# Altium schematic sheet BQ51013a.SchDoc
size A
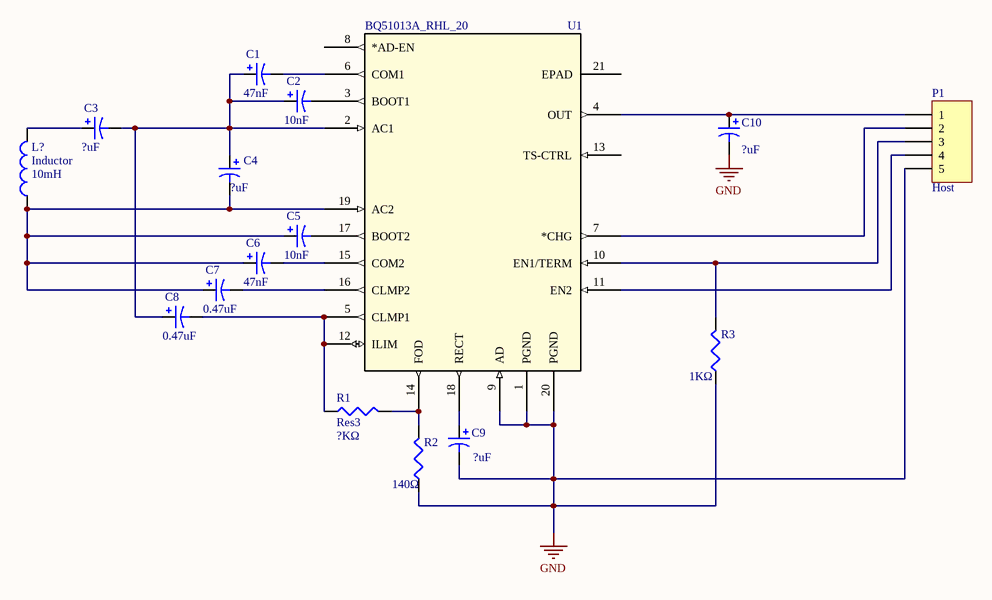
[diagram p0: BQ51013a.SchDoc]

## Parts
C1  value 47nF  [C0805]
C2  value 10nF  [C0805]
C3  value ?uF  [C0805]
C4  value ?uF  [C0805]
C5  value 10nF  [C0805]
C6  value 47nF  [C0805]
C7  value 0.47uF  [C0805]
C8  value 0.47uF  [C0805]
C9  value ?uF  [C0805]
C10  value ?uF  [C0805]
L?  Inductor  value 10mH  [0402-A]
P1  Host  [MHDR1X5]
R1  Res3  value ?KΩ  [J1-0603]
R2  value 140Ω  [J1-0603]
R3  value 1KΩ  [J1-0603]
U1  BQ51013A_RHL_20  [RHL20_2P05X3P05]

## Nets
GND: C9.2 C10.2 P1.5 R2.1 R3.1 U1.1(PGND) U1.9(AD) U1.20(PGND)
NetC1_1: C1.1 C2.1 C3.2 C4.1 C8.1 U1.2(AC1)
NetC1_2: C1.2 U1.6(COM1)
NetC2_2: C2.2 U1.3(BOOT1)
NetC3_1: C3.1 L?.2
NetC4_2: C4.2 C5.1 C6.1 C7.1 L?.1 U1.19(AC2)
NetC5_2: C5.2 U1.17(BOOT2)
NetC6_2: C6.2 U1.15(COM2)
NetC7_2: C7.2 U1.16(CLMP2)
NetC8_2: C8.2 R1.1 U1.5(CLMP1) U1.12(ILIM)
NetC9_1: C9.1 U1.18(RECT)
NetC10_1: C10.1 P1.1 U1.4(OUT)
NetP1_2: P1.2 U1.7(*CHG)
NetP1_3: P1.3 R3.2 U1.10(EN1/TERM)
NetP1_4: P1.4 U1.11(EN2)
NetR1_2: R1.2 R2.2 U1.14(FOD)

Not connected (* = marked no-connect by the designer): U1 8(*AD-EN) 13(TS-CTRL) 21(EPAD)

## Library data of the parts
C1-C10 = Cap Pol3: Polarized Capacitor (Surface Mount); Published: 8-Jun-2000; LatestRevisionDate: 29-May-2009; LatestRevisionNote: IPC-7351 Footprint Added.; PackageReference: C0805; Publisher: Altium Limited; PackageDescription: Chip Capacitor
L? = Inductor: Code_IEC: 1005; Published: 8-Jun-2000; LatestRevisionDate: 29-May-2009; LatestRevisionNote: IPC-7351 Footprint Added.; PackageReference: 0402-A; Publisher: Altium Limited; PackageDescription: Chip Inductor; Code_JEITA: 0402
P1 = MHDR1X5: Header, 5-Pin; LatestRevisionDate: 17-Jul-2002; LatestRevisionNote: Re-released for DXP Platform.; Publisher: Altium Limited
R1-R3 = Res3: Resistor; Published: 8-Jun-2000; LatestRevisionDate: 29-May-2009; LatestRevisionNote: IPC-7351 Footprint Added.; PackageReference: J1-0603; Publisher: Altium Limited; PackageDescription: Chip Resistor
U1 = BQ51013A_RHL_20: Imported; Vendor: TEXAS INSTRUMENTS; Manufacturer_Part_Number: bq51013a_rhl_20; Value: Value; Type: Type; RefDes: RefDes